# Altium schematic sheet FPGA_GPIOs.SchDoc: FPGA_GPIOs
size A4; Date: 18/06/2014; DrawnBy: J. Gabriel R.E.; Organization: Seven Solutions S.L.; Address1: C/Baza, Parcela 19, Nave 3; Address2: Polнgono Ind. Juncaril; Address3: 18210-Peligros-Granada; Address4: Spain; Revision: 3.4; SheetNumber: 16; SheetTotal: 23; WebAddress: www.sevensols.com; Project: White Rabbit; ProjectName: White Rabbit
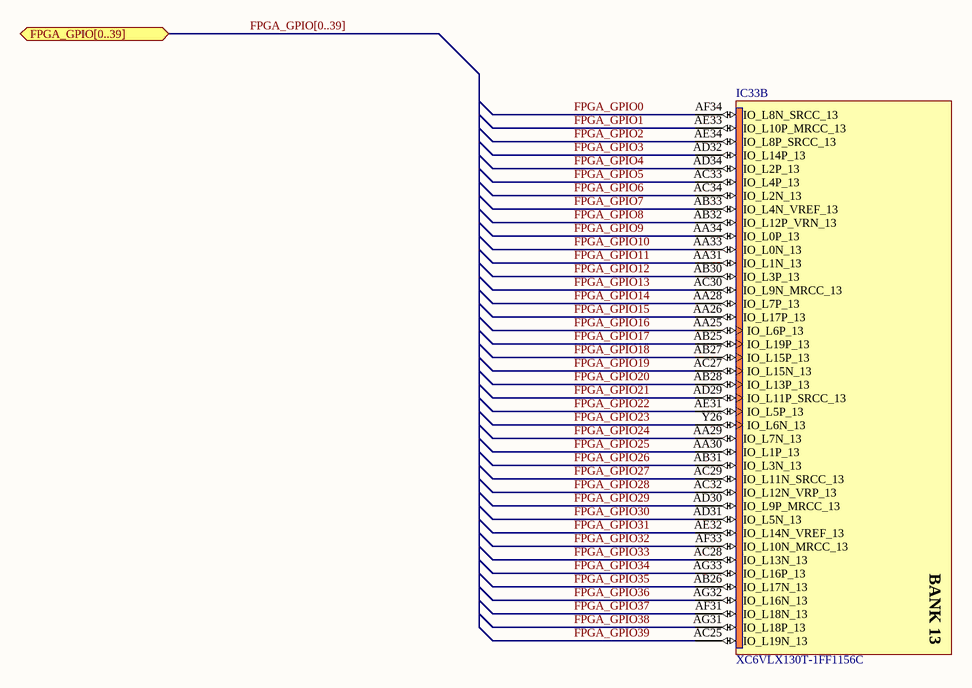
[diagram p0: FPGA_GPIOs.SchDoc]

## Parts
IC33  XC6VLX130T-1FF1156C  [FF1156]  (part B of 20)

## Ports
FPGA_GPIO[0..39] (bidir)

## Nets
FPGA_GPIO0: IC33.AF34(IO_L8N_SRCC_13)
FPGA_GPIO1: IC33.AE33(IO_L10P_MRCC_13)
FPGA_GPIO2: IC33.AE34(IO_L8P_SRCC_13)
FPGA_GPIO3: IC33.AD32(IO_L14P_13)
FPGA_GPIO4: IC33.AD34(IO_L2P_13)
FPGA_GPIO5: IC33.AC33(IO_L4P_13)
FPGA_GPIO6: IC33.AC34(IO_L2N_13)
FPGA_GPIO7: IC33.AB33(IO_L4N_VREF_13)
FPGA_GPIO8: IC33.AB32(IO_L12P_VRN_13)
FPGA_GPIO9: IC33.AA34(IO_L0P_13)
FPGA_GPIO10: IC33.AA33(IO_L0N_13)
FPGA_GPIO11: IC33.AA31(IO_L1N_13)
FPGA_GPIO12: IC33.AB30(IO_L3P_13)
FPGA_GPIO13: IC33.AC30(IO_L9N_MRCC_13)
FPGA_GPIO14: IC33.AA28(IO_L7P_13)
FPGA_GPIO15: IC33.AA26(IO_L17P_13)
FPGA_GPIO16: IC33.AA25(IO_L6P_13)
FPGA_GPIO17: IC33.AB25(IO_L19P_13)
FPGA_GPIO18: IC33.AB27(IO_L15P_13)
FPGA_GPIO19: IC33.AC27(IO_L15N_13)
FPGA_GPIO20: IC33.AB28(IO_L13P_13)
FPGA_GPIO21: IC33.AD29(IO_L11P_SRCC_13)
FPGA_GPIO22: IC33.AE31(IO_L5P_13)
FPGA_GPIO23: IC33.Y26(IO_L6N_13)
FPGA_GPIO24: IC33.AA29(IO_L7N_13)
FPGA_GPIO25: IC33.AA30(IO_L1P_13)
FPGA_GPIO26: IC33.AB31(IO_L3N_13)
FPGA_GPIO27: IC33.AC29(IO_L11N_SRCC_13)
FPGA_GPIO28: IC33.AC32(IO_L12N_VRP_13)
FPGA_GPIO29: IC33.AD30(IO_L9P_MRCC_13)
FPGA_GPIO30: IC33.AD31(IO_L5N_13)
FPGA_GPIO31: IC33.AE32(IO_L14N_VREF_13)
FPGA_GPIO32: IC33.AF33(IO_L10N_MRCC_13)
FPGA_GPIO33: IC33.AC28(IO_L13N_13)
FPGA_GPIO34: IC33.AG33(IO_L16P_13)
FPGA_GPIO35: IC33.AB26(IO_L17N_13)
FPGA_GPIO36: IC33.AG32(IO_L16N_13)
FPGA_GPIO37: IC33.AF31(IO_L18N_13)
FPGA_GPIO38: IC33.AG31(IO_L18P_13)
FPGA_GPIO39: IC33.AC25(IO_L19N_13)

## Buses and harness runs
bus FPGA_GPIO[0..39] = port FPGA_GPIO[0..39]

## Notes on the sheet
- Title:
- Size:
- Revision:
- A4
- Drawn by:
- Date:
- Sheet
- of
- Project:
- (in symbol XC6VLX130T-1FF1156C, part B) BANK 13

## Library data of the parts
IC33 = XC6VLX130T-1FF1156C: Virtex-6 LXT Platform FPGA, 600 User I/Os, 20 GTXs, 1156-Ball FFBGA, Speed Grade 1, Commercial Grade; FirstPublished: 17-Nov-2009; DatasheetVersion: v2.0, Sep-2009; PackageVersion: ver1.0, Jun-2009; PackageReference: FF1156; Publisher: Altium Limited; PackageDescription: 1156-Ball Flip-Chip Fine Pitch Ball Grid Array (FF1156); Code_JEDEC: MS-034-AAR-1; Code_IPC: BGA100P34X34-1156; ComponentLink1Description: Virtex-6 Datasheet; ComponentLink1URL: http://www.xilinx.com/support/documentation/data_sheets/ds150.pdf; ComponentLink2Description: Pinout Specification; ComponentLink2URL: http://www.xilinx.com/support/packagefiles/virtex-6-pkgs.htm; ComponentLink3Description: FF1156 Package Drawing; ComponentLink3URL: http://www.xilinx.com/support/documentation/package_specs/ff1156.pdf; ComponentLink4Description: Virtex-6 Documents; ComponentLink4URL: http://www.xilinx.com/support/documentation/virtex-6.htm; ComponentLink5Description: Xilinx.com Home; ComponentLink5URL: http://www.xilinx.com